# Altium project H-bridge.PrjPcb
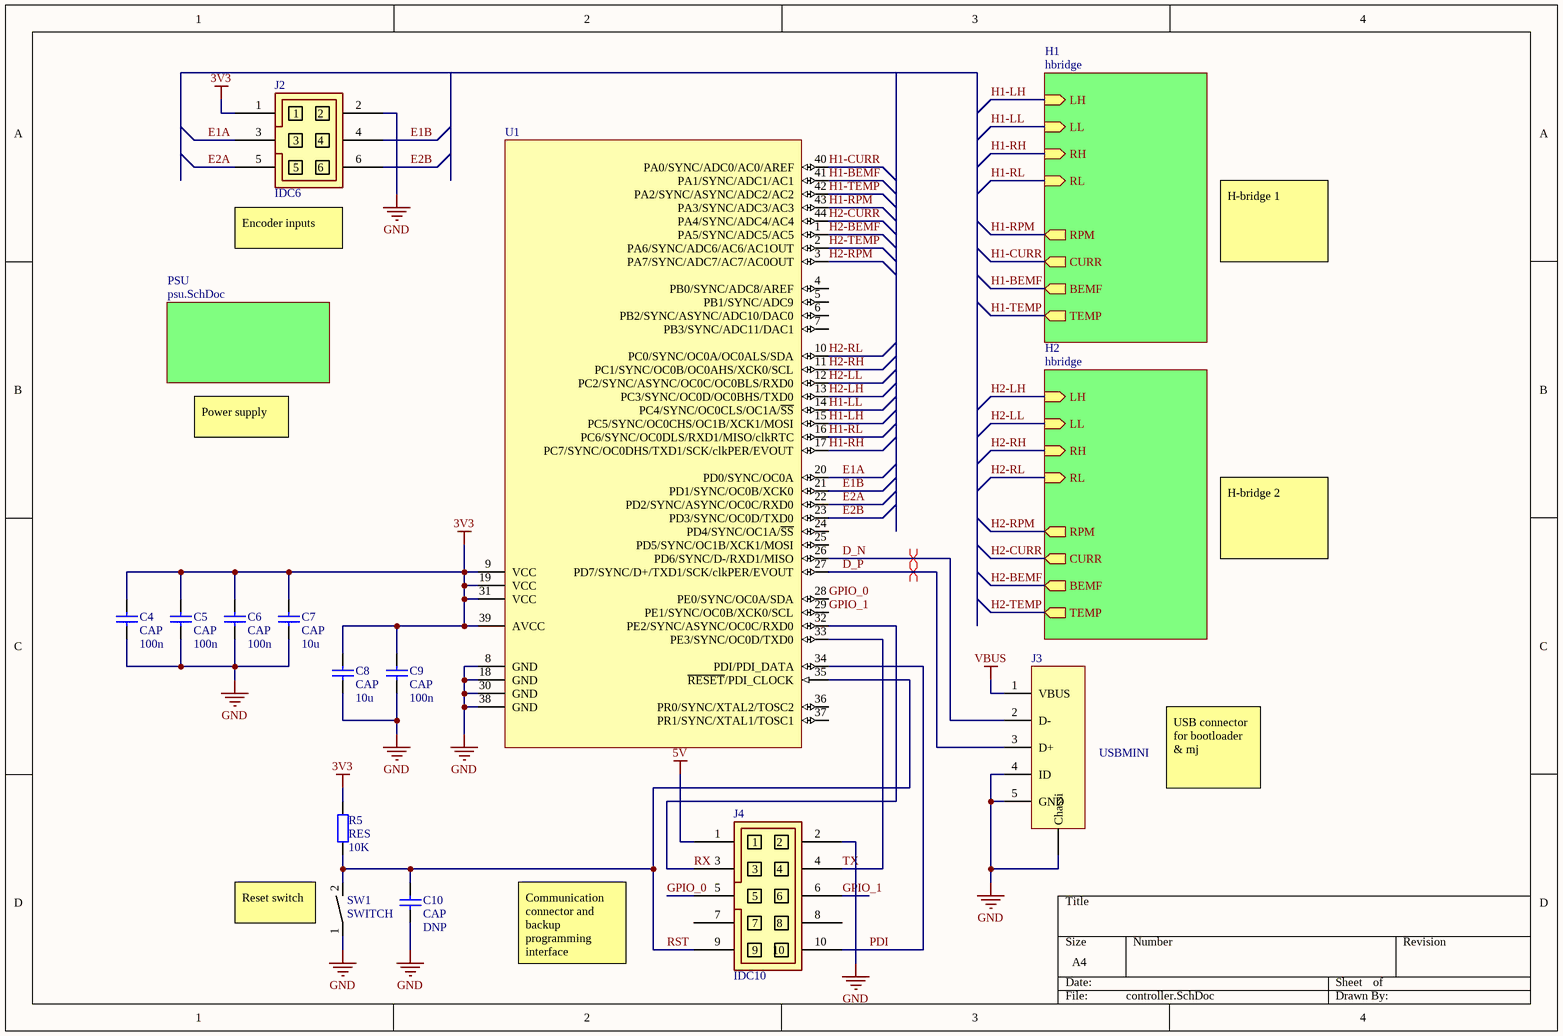
[diagram p0: controller.SchDoc]
3 sheets, 97 parts. Net scope: hierarchical (ports join the sheet entries above them; power ports are global).
Board file: hbridge.PcbDoc
Sheets:
  controller.SchDoc
    H1 = hbridge.SchDoc
    H2 = hbridge.SchDoc
    PSU = psu.SchDoc

## Sheet controller.SchDoc
size A4; PageSetup: Record=PageOptions|CenterHorizontal=True|CenterVertical=True|PrintScale=0.86|XCorrection=1.00|YCorrection=1.00|PrintKind=0|BorderSize=5000000|LeftOffset=0|BottomOffset=0|Orientation=1|PaperLength=1000|PaperWidth=1000|Scale=100|PaperSource=7|PrintQuality=-3|MediaType=1|DitherType=10|PrintScaleMode=1|PaperKind=A4|PaperIndex=9

### Parts
C4  CAP  value 100n  [CAPC1608X08M]
C5  CAP  value 100n  [CAPC1608X08M]
C6  CAP  value 100n  [CAPC1608X08M]
C7  CAP  value 10u  [CAPC1608X08M]
C8  CAP  value 10u  [CAPC2012X11M]
C9  CAP  value 100n  [CAPC1608X08M]
C10  CAP  value DNP  [CAPC1608X08M]
J2  IDC6  [IDC6]
J3  USBMINI  [MINI_USB]
J4  IDC10  [IDC10]
R5  RES  value 10K  [RESC1608X06M]
SW1  SWITCH  [Switch_pad]
U1  (no value)  [44A_N]

### Sub-sheets
H1 = hbridge: LH (in), LL (in), RH (in), RL (in), CURR (out), BEMF (out), TEMP (out), RPM (out)
H2 = hbridge: LH (in), LL (in), RH (in), RL (in), CURR (out), BEMF (out), TEMP (out), RPM (out)
PSU = psu.SchDoc: no entries

### Nets
3V3: C4.2 C5.2 C6.2 C7.2 C8.2 C9.2 J2.1 R5.2 U1.9(VCC) U1.19(VCC) U1.31(VCC) U1.39(AVCC)
5V: J4.1
GND: C4.1 C5.1 C6.1 C7.1 C8.1 C9.1 C10.1 J2.2 J3.4(ID) J3.5(GND) J3.C(Chassi) J4.2 SW1.1 U1.8(GND) U1.18(GND) U1.30(GND) U1.38(GND)
VBUS: J3.1(VBUS)
D_N: J3.2(D-) U1.26(PD6/SYNC/D-/RXD1/MISO)
D_P: J3.3(D+) U1.27(PD7/SYNC/D+/TXD1/SCK/clkPER/EVOUT)
E1A: J2.3 U1.20(PD0/SYNC/OC0A)
E1B: J2.4 U1.21(PD1/SYNC/OC0B/XCK0)
E2A: J2.5 U1.22(PD2/SYNC/ASYNC/OC0C/RXD0)
E2B: J2.6 U1.23(PD3/SYNC/OC0D/TXD0)
GPIO_0: J4.5 U1.28(PE0/SYNC/OC0A/SDA)
GPIO_1: J4.6 U1.29(PE1/SYNC/OC0B/XCK0/SCL)
H1-BEMF: U1.41(PA1/SYNC/ADC1/AC1) ; sheet H1/BEMF
H1-CURR: U1.40(PA0/SYNC/ADC0/AC0/AREF) ; sheet H1/CURR
H1-LH: U1.15(PC5/SYNC/OC0CHS/OC1B/XCK1/MOSI) ; sheet H1/LH
H1-LL: U1.14(PC4/SYNC/OC0CLS/OC1A/~{SS}) ; sheet H1/LL
H1-RH: U1.17(PC7/SYNC/OC0DHS/TXD1/SCK/clkPER/EVOUT) ; sheet H1/RH
H1-RL: U1.16(PC6/SYNC/OC0DLS/RXD1/MISO/clkRTC) ; sheet H1/RL
H1-RPM: U1.43(PA3/SYNC/ADC3/AC3) ; sheet H1/RPM
H1-TEMP: U1.42(PA2/SYNC/ASYNC/ADC2/AC2) ; sheet H1/TEMP
H2-BEMF: U1.1(PA5/SYNC/ADC5/AC5) ; sheet H2/BEMF
H2-CURR: U1.44(PA4/SYNC/ADC4/AC4) ; sheet H2/CURR
H2-LH: U1.13(PC3/SYNC/OC0D/OC0BHS/TXD0) ; sheet H2/LH
H2-LL: U1.12(PC2/SYNC/ASYNC/OC0C/OC0BLS/RXD0) ; sheet H2/LL
H2-RH: U1.11(PC1/SYNC/OC0B/OC0AHS/XCK0/SCL) ; sheet H2/RH
H2-RL: U1.10(PC0/SYNC/OC0A/OC0ALS/SDA) ; sheet H2/RL
H2-RPM: U1.3(PA7/SYNC/ADC7/AC7/AC0OUT) ; sheet H2/RPM
H2-TEMP: U1.2(PA6/SYNC/ADC6/AC6/AC1OUT) ; sheet H2/TEMP
PDI: J4.10 U1.34(PDI/PDI_DATA)
RST: C10.2 J4.9 R5.1 SW1.2 U1.35(~{RESET}/PDI_CLOCK)
RX: J4.3 U1.32(PE2/SYNC/ASYNC/OC0C/RXD0)
TX: J4.4 U1.33(PE3/SYNC/OC0D/TXD0)

Not connected (* = marked no-connect by the designer): J4 7 8; U1 4(PB0/SYNC/ADC8/AREF) 5(PB1/SYNC/ADC9) 6(PB2/SYNC/ASYNC/ADC10/DAC0) 7(PB3/SYNC/ADC11/DAC1) 24(PD4/SYNC/OC1A/~{SS}) 25(PD5/SYNC/OC1B/XCK1/MOSI) 36(PR0/SYNC/XTAL2/TOSC2) 37(PR1/SYNC/XTAL1/TOSC1)

### Layout directives
differential pair: D_N, D_P

### Notes on the sheet
- (near J2) Encoder inputs
- H-bridge 1
- Power supply
- H-bridge 2
- USB connector for bootloader & mj
- (near SW1) Reset switch
- Communication connector and backup programming interface

### Library data of the parts
C4-C10 = CAP: Capacitor; Published: 8-Jun-2000; LatestRevisionDate: 17-Jul-2002; LatestRevisionNote: Re-released for DXP Platform.; PackageReference: RB7.6-15; Publisher: Altium Limited; PackageDescription: Polarized Capacitor (Radial); 2 Leads
J2 = IDC6: 6pin IDC connector
J3 = MINI_USB
J4 = IDC10: 10pin IDC connector
R5 = RES: Resistor; Published: 8-Jun-2000; LatestRevisionDate: 17-Jul-2002; LatestRevisionNote: Re-released for DXP Platform.; PackageReference: AXIAL-0.4; Publisher: Altium Limited; PackageDescription: Axial Device, Thru-Hole; 2 Leads; 0.4 in Pin Spacing
U1 = ATxmega32A4U-AU: 8/16-bit AVR XMEGA A4U Microcontroller, 1.6-3.6V, 32MHz, 32K + 4KB Flash, 1K EEPROM, 4K SRAM, 44-pin TQFP, Industrial Grade (-40°C to 85°C); DatasheetVersion: revB, Dec-2011; PackageVersion: revC, Oct-2010; PackageReference: 44A; PackageDescription: 44-Pin Plastic Thin Profile Quad Flat Pack, 10 x 10 x 1.0 mm Body, 0.8 mm Pitch (TQFP); Code_JEDEC: MS-026-ACB; ComponentLink1Description: Manufacturer URL; ComponentLink1URL: http://www.atmel.com/; ComponentLink2Description: ATxmega16A4U/32A4U/64A4U/128A4U Datasheet; ComponentLink2URL: http://www.atmel.com/dyn/resources/prod_documents/doc8387.pdf

## Sheet hbridge.SchDoc
size A4
Used 2 times, as channels H1, H2. Parts and nets are listed once, with the designators drawn on the sheet.
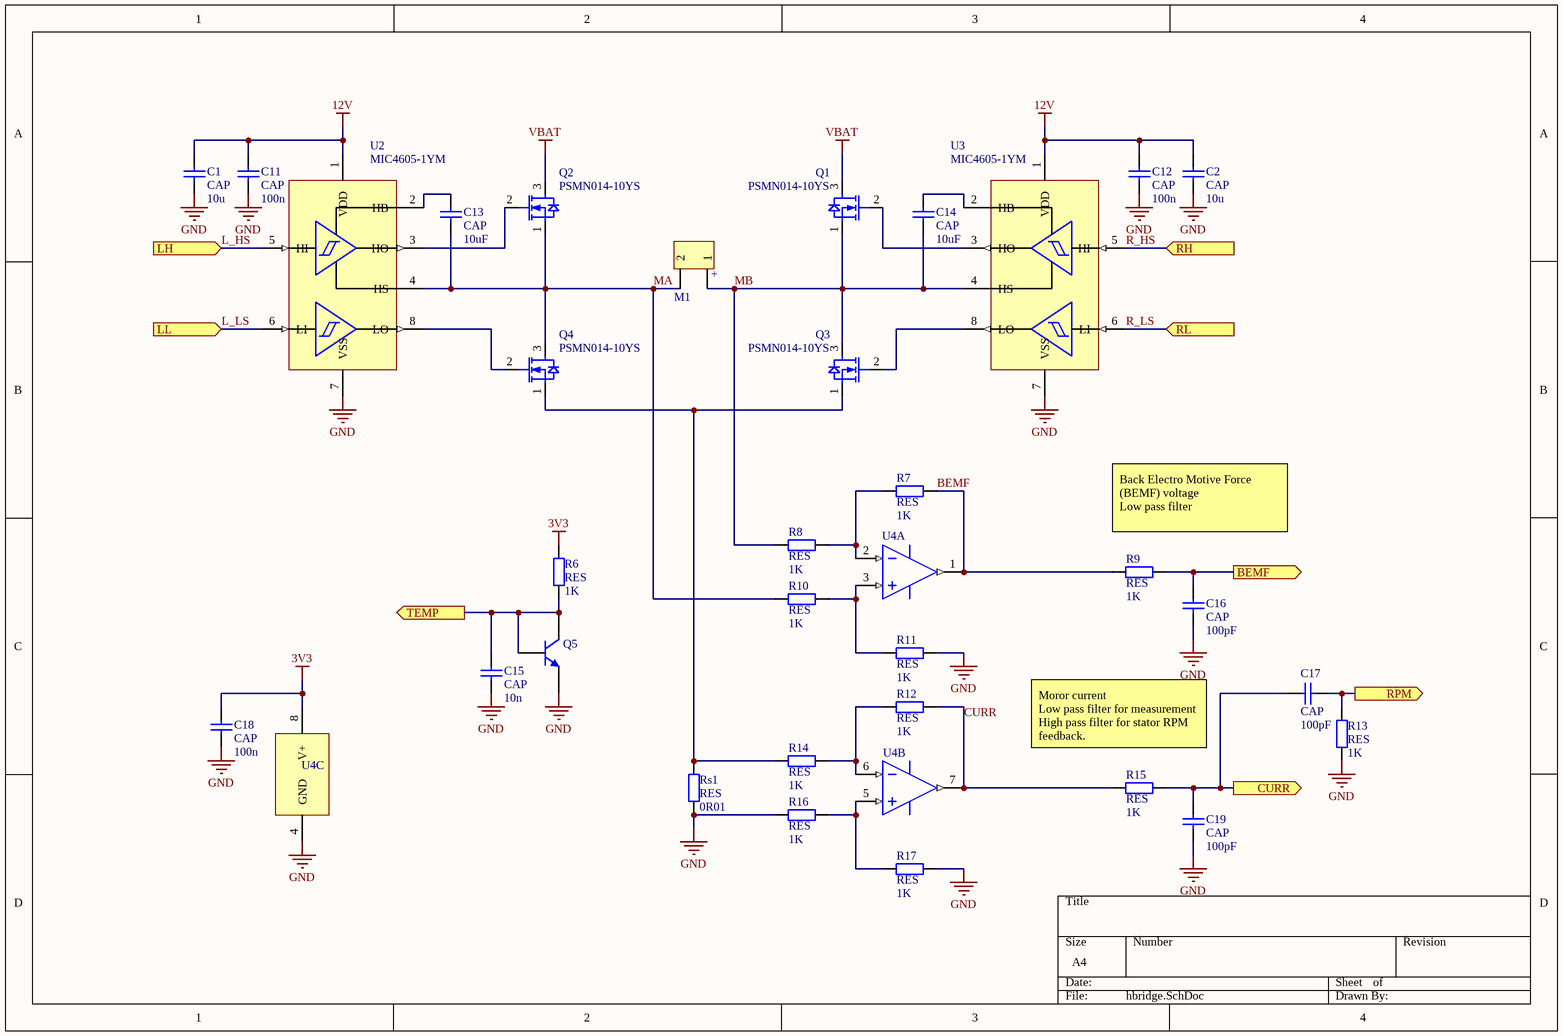
[diagram p1: hbridge.SchDoc]

### Parts
C1  CAP  value 10u  [CAPC2012X11M]
C2  CAP  value 10u  [CAPC2012X11M]
C11  CAP  value 100n  [CAPC1608X08M]
C12  CAP  value 100n  [CAPC1608X08M]
C13  CAP  value 10uF  [CAPC1608X08M]
C14  CAP  value 10uF  [CAPC1608X08M]
C15  CAP  value 10n  [CAPC1608X08M]
C16  CAP  value 100pF  [CAPC1608X08M]
C17  CAP  value 100pF  [CAPC1608X08M]
C18  CAP  value 100n  [CAPC1608X08M]
C19  CAP  value 100pF  [CAPC1608X08M]
M1  VBAT  [BAT_CNCTR]  (value not drawn)
Q1  PSMN014-10YS  [AGV_PWRSO2]
Q2  PSMN014-10YS  [AGV_PWRSO2]
Q3  PSMN014-10YS  [AGV_PWRSO2]
Q4  PSMN014-10YS  [AGV_PWRSO2]
Q5  (no value)  [SOT23]
R6  RES  value 1K  [RESC1608X06M]
R7  RES  value 1K  [RESC1608X06M]
R8  RES  value 1K  [RESC1608X06M]
R9  RES  value 1K  [RESC1608X06M]
R10  RES  value 1K  [RESC1608X06M]
R11  RES  value 1K  [RESC1608X06M]
R12  RES  value 1K  [RESC1608X06M]
R13  RES  value 1K  [RESC1608X06M]
R14  RES  value 1K  [RESC1608X06M]
R15  RES  value 1K  [RESC1608X06M]
R16  RES  value 1K  [RESC1608X06M]
R17  RES  value 1K  [RESC1608X06M]
Rs1  RES  value 0R01  [RESC2012X07M]
U2  MIC4605-1YM  [SOIC8]
U3  MIC4605-1YM  [SOIC8]
U4  (no value)  [TSSOP8]  (parts A,B,C of 3)

### Ports
BEMF (out), CURR (out), LH (in), LL (in), RH (in), RL (in), RPM (out), TEMP (out)

### Nets
3V3: C18.2 R6.2 U4.8(V+)
12V: C1.2 C2.2 C11.2 C12.2 U2.1(VDD) U3.1(VDD)
GND: C1.1 C2.1 C11.1 C12.1 C15.1 C16.1 C18.1 C19.1 Q5.1(E) R11.2 R13.2 R16.1 R17.2 Rs1.1 U2.7(VSS) U3.7(VSS) U4.4(GND)
VBAT: Q1.3(D) Q2.3(D)
BEMF: R7.2 R9.1 U4.1(OUTA)
BEMF: C16.2 R9.2 ; port BEMF  [a separate net that carries the same name]
CURR: R12.2 R15.1 U4.7(OUTB)
CURR: C17.1 C19.2 R15.2 ; port CURR  [a separate net that carries the same name]
L_HS: U2.5(HI) ; port LH
L_LS: U2.6(LI) ; port LL
MA: C13.1 M1.2 Q2.1(S) Q4.3(D) R10.1 U2.4(HS)
MB: C14.1 M1.1 Q1.1(S) Q3.3(D) R8.1 U3.4(HS)
R_HS: U3.5(HI) ; port RH
R_LS: U3.6(LI) ; port RL
RPM: C17.2 R13.1 ; port RPM
TEMP: C15.2 Q5.2(B) Q5.3(C) R6.1 ; port TEMP
NetC13_2: C13.2 U2.2(HB)
NetC14_2: C14.2 U3.2(HB)
NetQ1_2: Q1.2(D) U3.3(HO)
NetQ2_2: Q2.2(D) U2.3(HO)
NetQ3_1: Q3.1(S) Q4.1(S) R14.1 Rs1.2
NetQ3_2: Q3.2(D) U3.8(LO)
NetQ4_2: Q4.2(D) U2.8(LO)
NetR7_1: R7.1 R8.2 U4.2(INA-)
NetR10_2: R10.2 R11.1 U4.3(INA+)
NetR12_1: R12.1 R14.2 U4.6(INB-)
NetR16_2: R16.2 R17.1 U4.5(INB+)

### Channels
H1: designators end in _H1; ports BEMF=H1-BEMF CURR=H1-CURR LH=H1-LH LL=H1-LL RH=H1-RH RL=H1-RL RPM=H1-RPM TEMP=H1-TEMP
H2: designators end in _H2; ports BEMF=H2-BEMF CURR=H2-CURR LH=H2-LH LL=H2-LL RH=H2-RH RL=H2-RL RPM=H2-RPM TEMP=H2-TEMP

### Notes on the sheet
- (near R9) Back Electro Motive Force (BEMF) voltage
  Low pass filter
- (near R15) Moror current
  Low pass filter for measurement
  High pass filter for stator RPM feedback.
- (in symbol BAT_CNCTR) +

### Library data of the parts
C1 C2 C11-C19 = CAP: Capacitor; Published: 8-Jun-2000; LatestRevisionDate: 17-Jul-2002; LatestRevisionNote: Re-released for DXP Platform.; PackageReference: RB7.6-15; Publisher: Altium Limited; PackageDescription: Polarized Capacitor (Radial); 2 Leads
M1 = BAT_CNCTR: 2-pin batteri kontakt
Q5 = 2N3904: NPN General Purpose Amplifier; pin to pad: 1>2 2>1; Published: 8-Jun-2000; LatestRevisionDate: 15-Jan-2003; LatestRevisionNote: PCB Footprint 'BCY-W3/D4.7' replaced; DatasheetVersion: 1997; PackageVersion: Sep-1998; PackageReference: TO-92A; Publisher: Altium Limited; PackageDescription: TO, Flat Index; 3 In-Line, Axial Leads; Body Dia. 4.5mm; Leads 0.51 x 0.48 mm (max); ComponentLink1Description: Manufacturer Link; ComponentLink1URL: http://www.fairchildsemi.com/; ComponentLink2Description: Datasheet; ComponentLink2URL: http://www.fairchildsemi.com/ds/2N%2F2N3904.pdf
R6-R17 Rs1 = RES: Resistor; Published: 8-Jun-2000; LatestRevisionDate: 17-Jul-2002; LatestRevisionNote: Re-released for DXP Platform.; PackageReference: AXIAL-0.4; Publisher: Altium Limited; PackageDescription: Axial Device, Thru-Hole; 2 Leads; 0.4 in Pin Spacing
U4 = LM358PWR: Low Power Dual Operational Amplifier, 8-pin Narrow SOIC; PartNumber: LM358AM; Manufacturer: National Semiconductor; PackageTopMarking: NSZXTT*LM*358AM; PowerWise: N; CompType: Amplifiers; Published: 4-Dec-2008; LatestRevisionDate: 13-Jan-2009; LatestRevisionNote: Sim Model Added.; DatasheetVersion: Oct-2005; PackageVersion: revM, May-2009; PackageReference: M08A; Publisher: Altium Limited; PackageDescription: SOIC Narrow, 4.9 x 3.9 x 1.45mm, 8 Lead, 1.27mm Pitch; Supplier 1: Farnell; Supplier Part Number 1: 9486801; RoHS: N; PinCount: 8; Code_JEDEC: MS-012-AA; Code_IPC: SOIC127P600-8; ComponentLink1Description: LM358 Datasheet; ComponentLink1URL: http://www.national.com/ds/LM/LM358.pdf; ComponentLink2Description: LM358 Web Page; ComponentLink2URL: http://www.national.com/pf/LM/LM358.html; ComponentLink3Description: M08A Package Page; ComponentLink3URL: http://www.national.com/packaging/folders/m08a.html
Q1-Q4 = PSMN014-10YS: Published: 8-Jun-2000; LatestRevisionDate: 17-Jul-2002; LatestRevisionNote: Re-released for DXP Platform.; PackageVersion: 1995/1996; PackageReference: E3; Publisher: Altium Limited; PackageDescription: TO, Flat Index; 3 In-Line, Axial Leads; Body Dia. 4.6mm; Lead Dia. 0.5 mm (max)

## Sheet psu.SchDoc
size A4
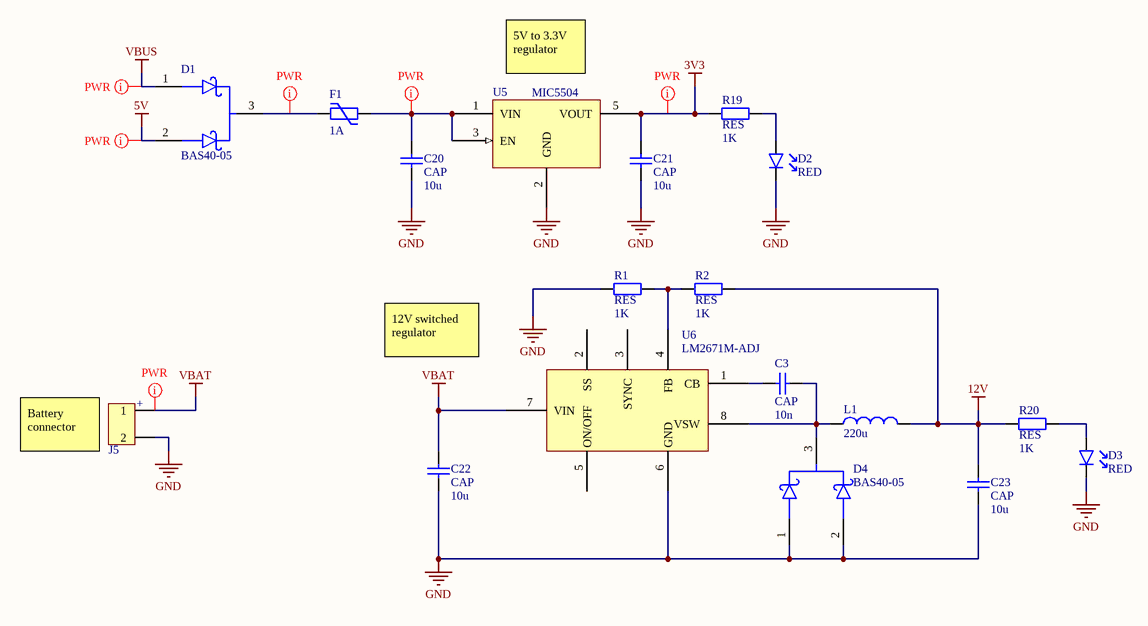
[diagram p2: psu.SchDoc]

### Parts
C3  CAP  value 10n  [CAPC1608X08M]
C20  CAP  value 10u  [CAPC2012X11M]
C21  CAP  value 10u  [CAPC2012X11M]
C22  CAP  value 10u  [CAPC3216X14M]
C23  CAP  value 10u  [CAPC3216X14M]
D1  BAS40-05  [SOT23]
D2  RED  [RESC1608X06M]
D3  RED  [RESC1608X06M]
D4  BAS40-05  [SOT23]
F1  value 1A  [RESC3216X07M]  (hidden comment: POLYFUSE)
J5  VBAT  [BAT_CNCTR]  (value not drawn)
L1  value 220u  [INDC3924X34M]  (hidden comment: IND)
R1  RES  value 1K  [RESC1608X06M]
R2  RES  value 1K  [RESC1608X06M]
R19  RES  value 1K  [RESC1608X06M]
R20  RES  value 1K  [RESC1608X06M]
U5  MIC5504  [SOT23-5]
U6  LM2671M-ADJ  [AGV_SO-8]

### Nets
3V3: C21.2 R19.1 U5.5(VOUT)
5V: D1.2(A2)
12V: C23.2 L1.2 R2.2 R20.1
GND: C20.1 C21.1 C22.1 C23.1 D2.2(K) D3.2(K) D4.1(A1) D4.2(A2) J5.2 R1.1 U5.2(GND) U6.6(GND)
VBAT: C22.2 J5.1 U6.7(VIN)
VBUS: D1.1(A1)
NetC3_1: C3.1 D4.3(K) L1.1 U6.8(VSW)
NetC3_2: C3.2 U6.1(CB)
NetC20_2: C20.2 F1.1 U5.1(VIN) U5.3(EN)
NetD1_3: D1.3(K) F1.2
NetD2_1: D2.1(A1) R19.2
NetD3_1: D3.1(A1) R20.2
NetR1_2: R1.2 R2.1 U6.4(FB)

Not connected (* = marked no-connect by the designer): U6 2(SS) 3(SYNC) 5(ON/OFF)

### Layout directives
rule Width Constraint [Pref Width = 0.75mm    Min Width = 0.4mm    Max Width = 5mm]: 3V3, 5V, NetC20_2, NetD1_3, VBAT, VBUS

### Notes on the sheet
- (near U5) 5V to 3.3V regulator
- 12V switched regulator
- (near J5) Battery connector
- (in symbol BAT_CNCTR) +

### Library data of the parts
C3 C20-C23 = CAP: Capacitor; Published: 8-Jun-2000; LatestRevisionDate: 17-Jul-2002; LatestRevisionNote: Re-released for DXP Platform.; PackageReference: RB7.6-15; Publisher: Altium Limited; PackageDescription: Polarized Capacitor (Radial); 2 Leads
D2 D3 = LED
J5 = BAT_CNCTR: 2-pin batteri kontakt
L1 = AGV_IND: Inductor; Published: 8-Jun-2000; LatestRevisionDate: 17-Jul-2002; LatestRevisionNote: Re-released for DXP Platform.; PackageReference: AXIAL-0.4; Publisher: Altium Limited; PackageDescription: Axial Device, Thru-Hole; 2 Leads; 0.4 in Pin Spacing
R1 R2 R19 R20 = RES: Resistor; Published: 8-Jun-2000; LatestRevisionDate: 17-Jul-2002; LatestRevisionNote: Re-released for DXP Platform.; PackageReference: AXIAL-0.4; Publisher: Altium Limited; PackageDescription: Axial Device, Thru-Hole; 2 Leads; 0.4 in Pin Spacing
U5 = MIC5504-3.3
U6 = LM2671M
F1 = POLYFUSE: Published: 8-Jun-2000; LatestRevisionDate: 17-Jul-2002; LatestRevisionNote: Re-released for DXP Platform.; PackageReference: AXIAL-0.4; Publisher: Altium Limited; PackageDescription: Axial Device, Thru-Hole; 2 Leads; 0.4 in Pin Spacing

## Nets that join several sheets
3V3: controller (12 pins), H1 (C18_H1.2 R6_H1.2 U4_H1.8), H2 (C18_H2.2 R6_H2.2 U4_H2.8), psu (C21.2 R19.1 U5.5)
5V: controller (J4.1), psu (D1.2)
12V: H1 (6 pins), H2 (6 pins), psu (C23.2 L1.2 R2.2 R20.1)
GND: controller (17 pins), H1 (17 pins), H2 (17 pins), psu (12 pins)
VBAT: H1 (Q1_H1.3 Q2_H1.3), H2 (Q1_H2.3 Q2_H2.3), psu (C22.2 J5.1 U6.7)
VBUS: controller (J3.1), psu (D1.1)
H1-BEMF: controller (U1.41), H1 (C16_H1.2 R9_H1.2)
H1-CURR: controller (U1.40), H1 (C17_H1.1 C19_H1.2 R15_H1.2)
H1-LH: controller (U1.15), H1 (U2_H1.5)
H1-LL: controller (U1.14), H1 (U2_H1.6)
H1-RH: controller (U1.17), H1 (U3_H1.5)
H1-RL: controller (U1.16), H1 (U3_H1.6)
H1-RPM: controller (U1.43), H1 (C17_H1.2 R13_H1.1)
H1-TEMP: controller (U1.42), H1 (C15_H1.2 Q5_H1.2 Q5_H1.3 R6_H1.1)
H2-BEMF: controller (U1.1), H2 (C16_H2.2 R9_H2.2)
H2-CURR: controller (U1.44), H2 (C17_H2.1 C19_H2.2 R15_H2.2)
H2-LH: controller (U1.13), H2 (U2_H2.5)
H2-LL: controller (U1.12), H2 (U2_H2.6)
H2-RH: controller (U1.11), H2 (U3_H2.5)
H2-RL: controller (U1.10), H2 (U3_H2.6)
H2-RPM: controller (U1.3), H2 (C17_H2.2 R13_H2.1)
H2-TEMP: controller (U1.2), H2 (C15_H2.2 Q5_H2.2 Q5_H2.3 R6_H2.1)